# Altium schematic sheet GPS-IMU.SchDoc: Gransmaster GPS & IMU
size Tabloid; Author: N Smith; Revision: A; SheetNumber: 4; SheetTotal: 6; Customer: 01910
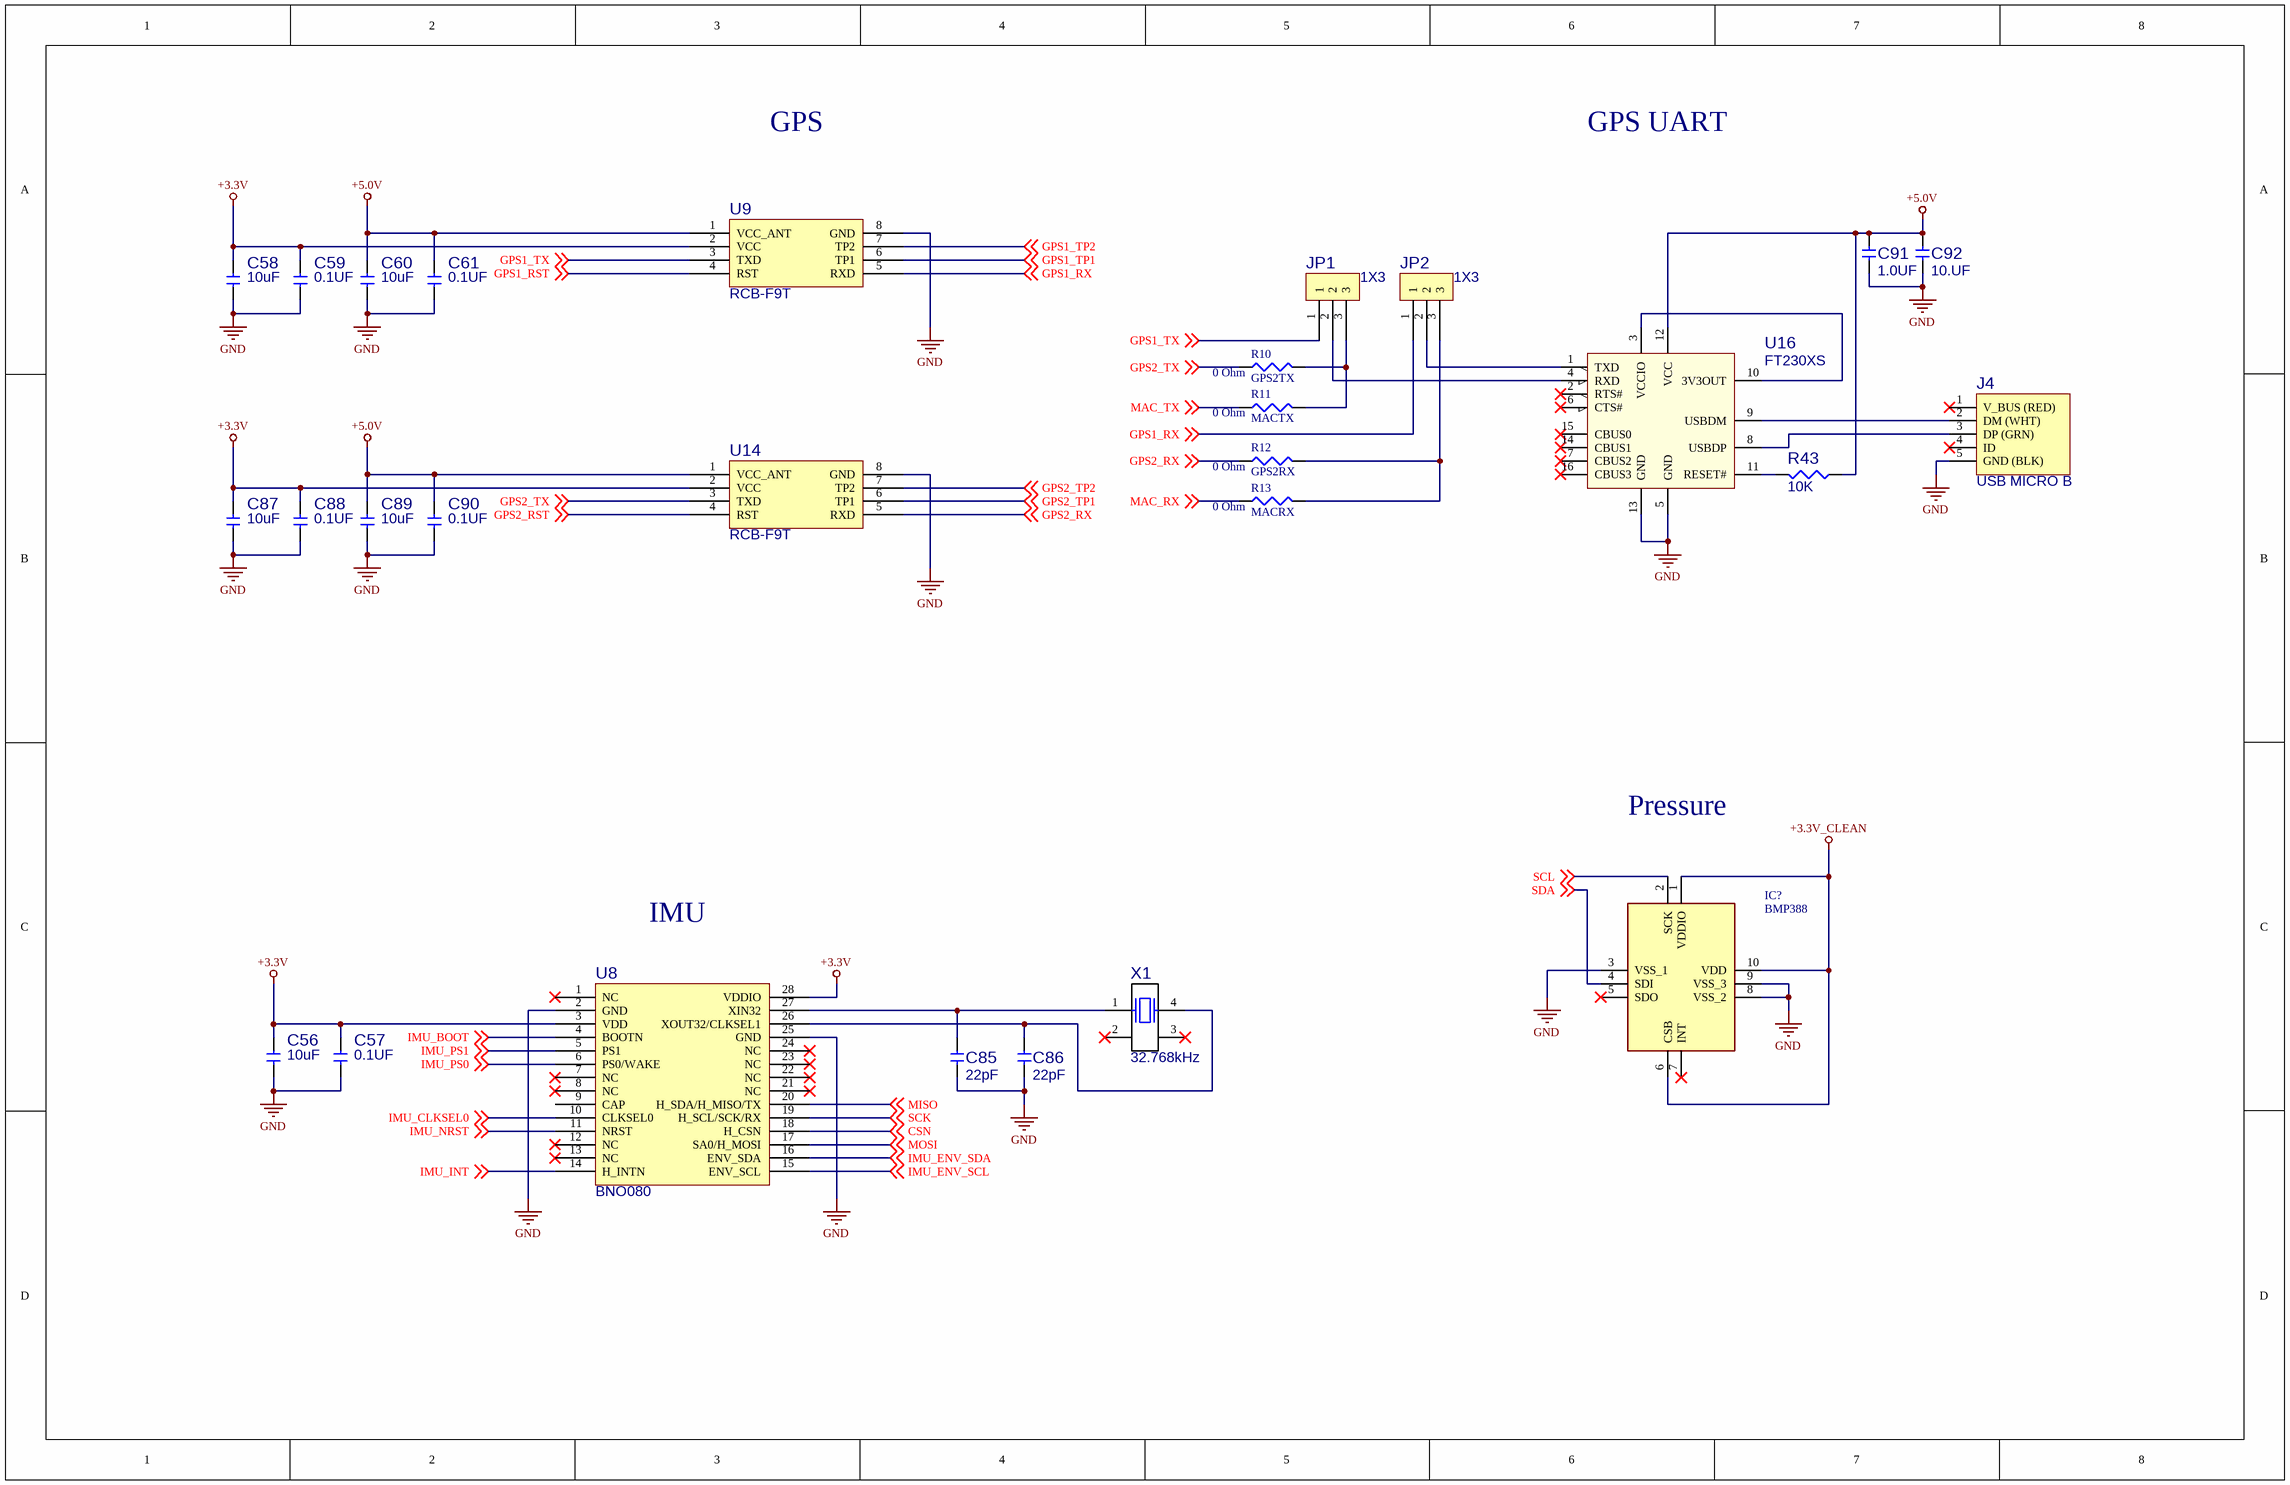
[diagram p0: GPS-IMU.SchDoc]

## Parts
C56  value 10uF  [CAPC2012X14N]  (hidden comment: CAP_0805_10UF_25V)
C57  value 0.1UF  [CAPC1005X06N]  (hidden comment: CAP_0402_0.1UF_50V)
C58  value 10uF  [CAPC2012X14N]  (hidden comment: CAP_0805_10UF_25V)
C59  value 0.1UF  [CAPC1005X06N]  (hidden comment: CAP_0402_0.1UF_50V)
C60  value 10uF  [CAPC2012X14N]  (hidden comment: CAP_0805_10UF_25V)
C61  value 0.1UF  [CAPC1005X06N]  (hidden comment: CAP_0402_0.1UF_50V)
C85  value 22pF  [CAPC1608X10N]  (hidden comment: CAP_0603_22PF_50V)
C86  value 22pF  [CAPC1608X10N]  (hidden comment: CAP_0603_22PF_50V)
C87  value 10uF  [CAPC2012X14N]  (hidden comment: CAP_0805_10UF_25V)
C88  value 0.1UF  [CAPC1005X06N]  (hidden comment: CAP_0402_0.1UF_50V)
C89  value 10uF  [CAPC2012X14N]  (hidden comment: CAP_0805_10UF_25V)
C90  value 0.1UF  [CAPC1005X06N]  (hidden comment: CAP_0402_0.1UF_50V)
C91  value 1.0UF  [CAPC2012X14N]  (hidden comment: CAP_0805_1UF_25V)
C92  value 10.UF  [CAPC1608X10N]  (hidden comment: GRT188R61E106ME13D)
IC?  BMP388  [BMP388]
J4  value USB MICRO B  [USB_47346-1001]  (hidden comment: 473461001)
JP1  value 1X3  [3PINV-100]  (hidden comment: JUMPER_3PIN)
JP2  value 1X3  [3PINV-100]  (hidden comment: JUMPER_3PIN)
R10  GPS2TX  value 0 Ohm  [J1-0603]
R11  MACTX  value 0 Ohm  [J1-0603]
R12  GPS2RX  value 0 Ohm  [J1-0603]
R13  MACRX  value 0 Ohm  [J1-0603]
R43  value 10K  [RESC1608X50N]  (hidden comment: ERJ-3EKF1002V)
U8  BNO080  [LGA-28]
U9  RCB-F9T  [RCB-F9T]
U14  RCB-F9T  [RCB-F9T]
U16  value FT230XS  [SOP64P600X170-16N]  (hidden comment: FT230XS-R)
X1  value 32.768kHz  [SM8]  (hidden comment: MC306)

## Nets
+3.3V: C56.1 C57.1 C58.1 C59.1 C87.1 C88.1 U8.3(VDD) U8.28(VDDIO) U9.2(VCC) U14.2(VCC)
+3.3V_CLEAN: IC?.1(VDDIO) IC?.6(CSB) IC?.10(VDD)
+5.0V: C60.1 C61.1 C89.1 C90.1 C91.2 C92.2 R43.1 U9.1(VCC_ANT) U14.1(VCC_ANT) U16.12(VCC)
GND: C56.2 C57.2 C58.2 C59.2 C60.2 C61.2 C85.1 C86.1 C87.2 C88.2 C89.2 C90.2 C91.1 C92.1 IC?.3(VSS_1) IC?.8(VSS_2) IC?.9(VSS_3) J4.5(GND_(BLK)) U8.2(GND) U8.25(GND) U9.8(GND) U14.8(GND) U16.5(GND) U16.13(GND)
CSN: U8.18(H_CSN) ; off-sheet CSN
GPS1_RST: U9.4(RST) ; off-sheet GPS1_RST
GPS1_RX: JP2.1 U9.5(RXD) ; off-sheet GPS1_RX
GPS1_TP1: U9.6(TP1) ; off-sheet GPS1_TP1
GPS1_TP2: U9.7(TP2) ; off-sheet GPS1_TP2
GPS1_TX: JP1.1 U9.3(TXD) ; off-sheet GPS1_TX
GPS2_RST: U14.4(RST) ; off-sheet GPS2_RST
GPS2_RX: R12.1 U14.5(RXD) ; off-sheet GPS2_RX
GPS2_TP1: U14.6(TP1) ; off-sheet GPS2_TP1
GPS2_TP2: U14.7(TP2) ; off-sheet GPS2_TP2
GPS2_TX: R10.1 U14.3(TXD) ; off-sheet GPS2_TX
IMU_BOOT: U8.4(BOOTN) ; off-sheet IMU_BOOT
IMU_CLKSEL0: U8.10(CLKSEL0) ; off-sheet IMU_CLKSEL0
IMU_ENV_SCL: U8.15(ENV_SCL) ; off-sheet IMU_ENV_SCL
IMU_ENV_SDA: U8.16(ENV_SDA) ; off-sheet IMU_ENV_SDA
IMU_INT: U8.14(H_INTN) ; off-sheet IMU_INT
IMU_NRST: U8.11(NRST) ; off-sheet IMU_NRST
IMU_PS0: U8.6(PS0/WAKE) ; off-sheet IMU_PS0
IMU_PS1: U8.5(PS1) ; off-sheet IMU_PS1
MAC_RX: R13.1 ; off-sheet MAC_RX
MAC_TX: R11.1 ; off-sheet MAC_TX
MISO: U8.20(H_SDA/H_MISO/TX) ; off-sheet MISO
MOSI: U8.17(SA0/H_MOSI) ; off-sheet MOSI
SCK: U8.19(H_SCL/SCK/RX) ; off-sheet SCK
SCL: IC?.2(SCK) ; off-sheet SCL
SDA: IC?.4(SDI) ; off-sheet SDA
NetC85_2: C85.2 U8.27(XIN32) X1.1
NetC86_2: C86.2 U8.26(XOUT32/CLKSEL1) X1.4
NetJ4_2: J4.2(DM_(WHT)) U16.9(USBDM)
NetJ4_3: J4.3(DP_(GRN)) U16.8(USBDP)
NetJP1_2: JP1.2 U16.4(RXD)
NetJP1_3: JP1.3 R10.2 R11.2
NetJP2_2: JP2.2 U16.1(TXD)
NetJP2_3: JP2.3 R12.2 R13.2
NetR43_2: R43.2 U16.11(RESET#)
NetU16_3: U16.3(VCCIO) U16.10(3V3OUT)

Not connected (* = marked no-connect by the designer): IC? 5(SDO)* 7(INT)*; J4 1(V_BUS_(RED))* 4(ID)*; U8 1(NC)* 7(NC)* 8(NC)* 9(CAP) 12(NC)* 13(NC)* 21(NC)* 22(NC)* 23(NC)* 24(NC)*; U16 2(RTS#)* 6(CTS#)* 7(CBUS2)* 14(CBUS1)* 15(CBUS0)* 16(CBUS3)*; X1 2* 3*

## Notes on the sheet
- GPS
- GPS UART
- Pressure
- IMU

## Library data of the parts
C56 C58 C60 C87 C89 = CAP_0805_10UF_25V: CAP, CER, 10.UF, 25V, 10%, X5R, 0805; MFG PART NUM: TMK212BBJ106KG-T; VALENTIUM PART NUM: <VALENTIUM>; MFG NAME: TAIYO YUDEN; MAXTEMP: 85C; MINTEMP: -55C; DESC: CAP, CER, 10.UF, 10V, 10%, X5R, 0805; MODIFY DATE: 10/23/2013; CATEGORY: CAP, CER; Date: 4/11/2006 3:37:28 PM; SHEETPART: *; P1: 10%; P2: 25V; P3: X5R; Size: 0805; Supplier 1: MOUSER; Supplier Part Number 1: 963-TMK212BBJ106KG-T
C57 C59 C61 C88 C90 = CAP_0402_0.1UF_50V: CAP, CER, 0.1UF, 50V, 10%, X7R, AEC-Q200, 0402; MFG PART NUM: CGA2B3X7R1H104K050BB; VALENTIUM PART NUM: <VALENTIUM>; MFG NAME: TDK; MAXTEMP: 125C; MINTEMP: -55C; CATEGORY: CAP, CER; MODIFY DATE: 10/23/2013; SHEETPART: *; P1: 10%; OTHER: AEC-Q200; P2: 50V; P3: X7R; Size: 0402; DESC: CAP, CER, 0.1UF, 50V, 10%, X7R, AEC-Q200, 0402; Supplier 1: Digi-Key; Supplier Part Number 1: 445-6899-1-ND
C85 C86 = CAP_0603_22PF_50V: CAP, CER, 22.PF, 50V, 5%, NPO, 0603; MFG PART NUM: C0603C220J5GACTU; VALENTIUM PART NUM: <VALENTIUM>; MFG NAME: KEMET; MAXTEMP: 125C; MINTEMP: -55C; P3: NP0; CATEGORY: CAP, CER; MODIFY DATE: 10/23/2013; Date: 7/25/2013; SHEETPART: *; P1: 5%; P2: 50V; Size: 0603; Supplier 1: Digi-Key; Supplier Part Number 1: 399-1053-1-ND; DESC: CAP, CER, 22.PF, 50V, 5%, NPO, 0603
C91 = CAP_0805_1UF_25V: CAP, CER, 1.0UF, 25V, 10%, X5R, 0805; MFG PART NUM: 08053D105KAT2A; VALENTIUM PART NUM: <VALENTIUM>; MFG NAME: AVX; MAXTEMP: 85C; MINTEMP: -55C; MODIFY DATE: 10/23/2013; CATEGORY: CAP, CER; Date: 4/11/2006 3:37:28 PM; SHEETPART: *; P1: 10%; P2: 25V; P3: X5R; Size: 0805; Supplier 1: Digi-Key; Supplier Part Number 1: 478-1409-1-ND; DESC: CAP, CER, 1.0UF, 25V, 10%, X5R, 0805
C92 = CAP_0603_10UF_25V: CAP, CER, 10.UF, 25V, 20%, X5R, AEC-Q200, 0603; VALENTIUM PART NUM: <VALENTIUM>; MFG NAME: MURATA; MAXTEMP: 85C; MINTEMP: -55C; CATEGORY: CAP, CER; MFG PART NUM: GRT188R61E106ME13D; MODIFY DATE: 10/23/2013; Date: 7/25/2013; SHEETPART: *; P1: 20%; OTHER: AEC-Q200; P2: 25V; P3: X5R; Size: 0603; DESC: CAP, CER, 10.UF, 25V, 20%, X5R, AEC-Q200, 0603; Supplier 1: Digi-Key; Supplier Part Number 1: 490-12323-6-ND
IC? = BMP388: Integrated Circuit; Manufacturer_Name: Bosch Sensortec; Datasheet Link: https://ae-bst.resource.bosch.com/media/_tech/media/datasheets/BST-BMP388-DS001-01.pdf; Height: 0mm; Manufacturer_Part_Number: BMP388; Arrow Part Number: BMP388; Arrow Price/Stock: https://www.arrow.com/en/products/bmp388/bosch; Mouser Part Number: 262-BMP388; Mouser Price/Stock: https://www.mouser.co.uk/ProductDetail/Bosch-Sensortec/BMP388?qs=rrS6PyfT74eIcD5Rv1Kf7A%3D%3D
J4 = USB_B_473461001: CONN, REC, USB, R/A, MICRO, TYPE B, 5 POS, SMT FLANGELESS; VALENTIUM PART NUM: <VALENTIUM>; MFG NAME: MOLEX; MAXTEMP: 85C; MINTEMP: -30C; P2: 5 POS; CATEGORY: CONN, REC; MODIFY DATE: 10/10/2013; OTHER: FLANGELESS; P1: R/A; P3: USB MICRO B; SIZE: SMT; MFG PART NUM: 473461001; DESC: CONN, REC, USB, R/A, MICRO, TYPE B, 5 POS, SMT FLANGELESS; Supplier 1: Digi-Key; Supplier Part Number 1: WM11228CT-ND
JP1 JP2 = JUMPER_3PIN: CONN, HDR, 1X3, VERT, .1, JUMPER, TH; MFG PART NUM: TSW-103-08-G-S; VALENTIUM PART NUM: <VALENTIUM>; MFG NAME: SAMTEC; MAXTEMP: C; OTHER: TSW-1XX; P2: .1; P3: FEATURE; CATEGORY: CONN, HDR; MODIFY DATE: 10/10/2013; MINTEMP: C; P1: VERT; SIZE: TH; Supplier 1: Digi-Key; Supplier Part Number 1: SAM1038-02-ND; DESC: CONN, HDR, 1X3, VERT, .1, JUMPER, TH
R10-R13 = Res3: Resistor; Published: 8-Jun-2000; LatestRevisionDate: 29-May-2009; LatestRevisionNote: IPC-7351 Footprint Added.; PackageReference: J1-0603; Publisher: Altium Limited; PackageDescription: Chip Resistor
R43 = RES_0603_10K: RES, 10K, 1%, 1/10W, TF, 0603; VELENTIUM PART NUM: <VELENTIUM>; MFG NAME: PANASONIC; MAXTEMP: 125C; MINTEMP: -55C; OTHER: 100PPM; SUB: GENERIC; ModifyDate: 7/25/2013; MFG PART NUM: ERJ-3EKF1002V; CATEGORY: RES; Date: 7/26/2013; P1: 1%; P3: TF; P2: 1/10W; SIZE: 0603; Supplier 1: Digi-Key; Supplier Part Number 1: P10.0KHCT-ND; SHEETPART: *; DESC: RES, 10K, 1%, 1/10W, TF, 0603
U8 = BNO080: MOD, IMU, 5.2X3.8, SMT; VELENTIUM PART NUM: <V PART NUM>; MFG NAME: HILLCREST; MAXTEMP: +85C; MINTEMP: -40C; MFG PART NUM: BNO080; MODIFY DATE: 10/21/2013; CATEGORY: MOD; OTHER: IMU; SIZE: 5.2X3.8; SHEETPART: *; DESC: MOD, IMU, 5.2X3.8, SMT; Supplier 1: Digi-Key; Supplier Part Number 1: 1888-1000-1-ND; VALUE: BNO080
U9 U14 = RCB-F9T: MOD, GPS; VELENTIUM PART NUM: <V PART NUM>; MFG NAME: UBLOCKS; MINTEMP: -40C; MAXTEMP: 80C; DESC: MOD BLE 4.2; MFG PART NUM: RCB-F9T; CATEGORY: MOD; MODIFY DATE: 9/11/13; P1: GPS; SHEETPART: *; DATE: .; Supplier 1: Digi-Key; Supplier Part Number 1: 672-RCB-F9T-ND
U16 = FT230XS-R: IC, TCVR, FT230, USB TO UART, 5V, FTDI, 16SSOP; VELENTIUM PART NUM: <V PART NUM>; MAXTEMP: 85C; MINTEMP: -40C; MFG PART NUM: FT230XS-R; MFG NAME: FTDI; MODIFY DATE: 8/14/2013; CATEGORY: IC, TCVR; P1: USB TO UART; P2: 5V; P3: FTDI; SIZE: 20SSOP; SHEETPART: *; DESC: IC, TCVR, FT230, USB TO UART, 5V, FTDI, 16SSOP; Supplier 1: Digi-Key; Supplier Part Number 1: 768-1135-1-ND
X1 = MC306: XTAL, 32.768KHZ, 6PF LOAD CAP, SMD, ROHS; MFG PART NUM: MC-306 32.768K-E3:ROHS; VALENTIUM PART NUM: <VALENTIUM>; MFG NAME: ABRACON CORPORATION; MAXTEMP: 85C; MINTEMP: -40C; P2: 20PPM; P3: FUNDAMENTAL; OTHER: MC306, 3.8X8.00X2.54MM; DESC: XTAL, <VAL>, P1, P2, P3, EIA, OTHER; CATEGORY: XTAL; MODIFY DATE: 9/5/2013; P1: 6PF; Supplier 1: Digi-Key; Supplier Part Number 1: SER2417CT-ND; SIZE: 4-SOJ; SHEETPART: *